# EAGLE schematic data board (EAGLE 9.6.2)
COMPANY: ADAFRUIT INDUSTRIES; DRAWN: LADYADA; REV: A
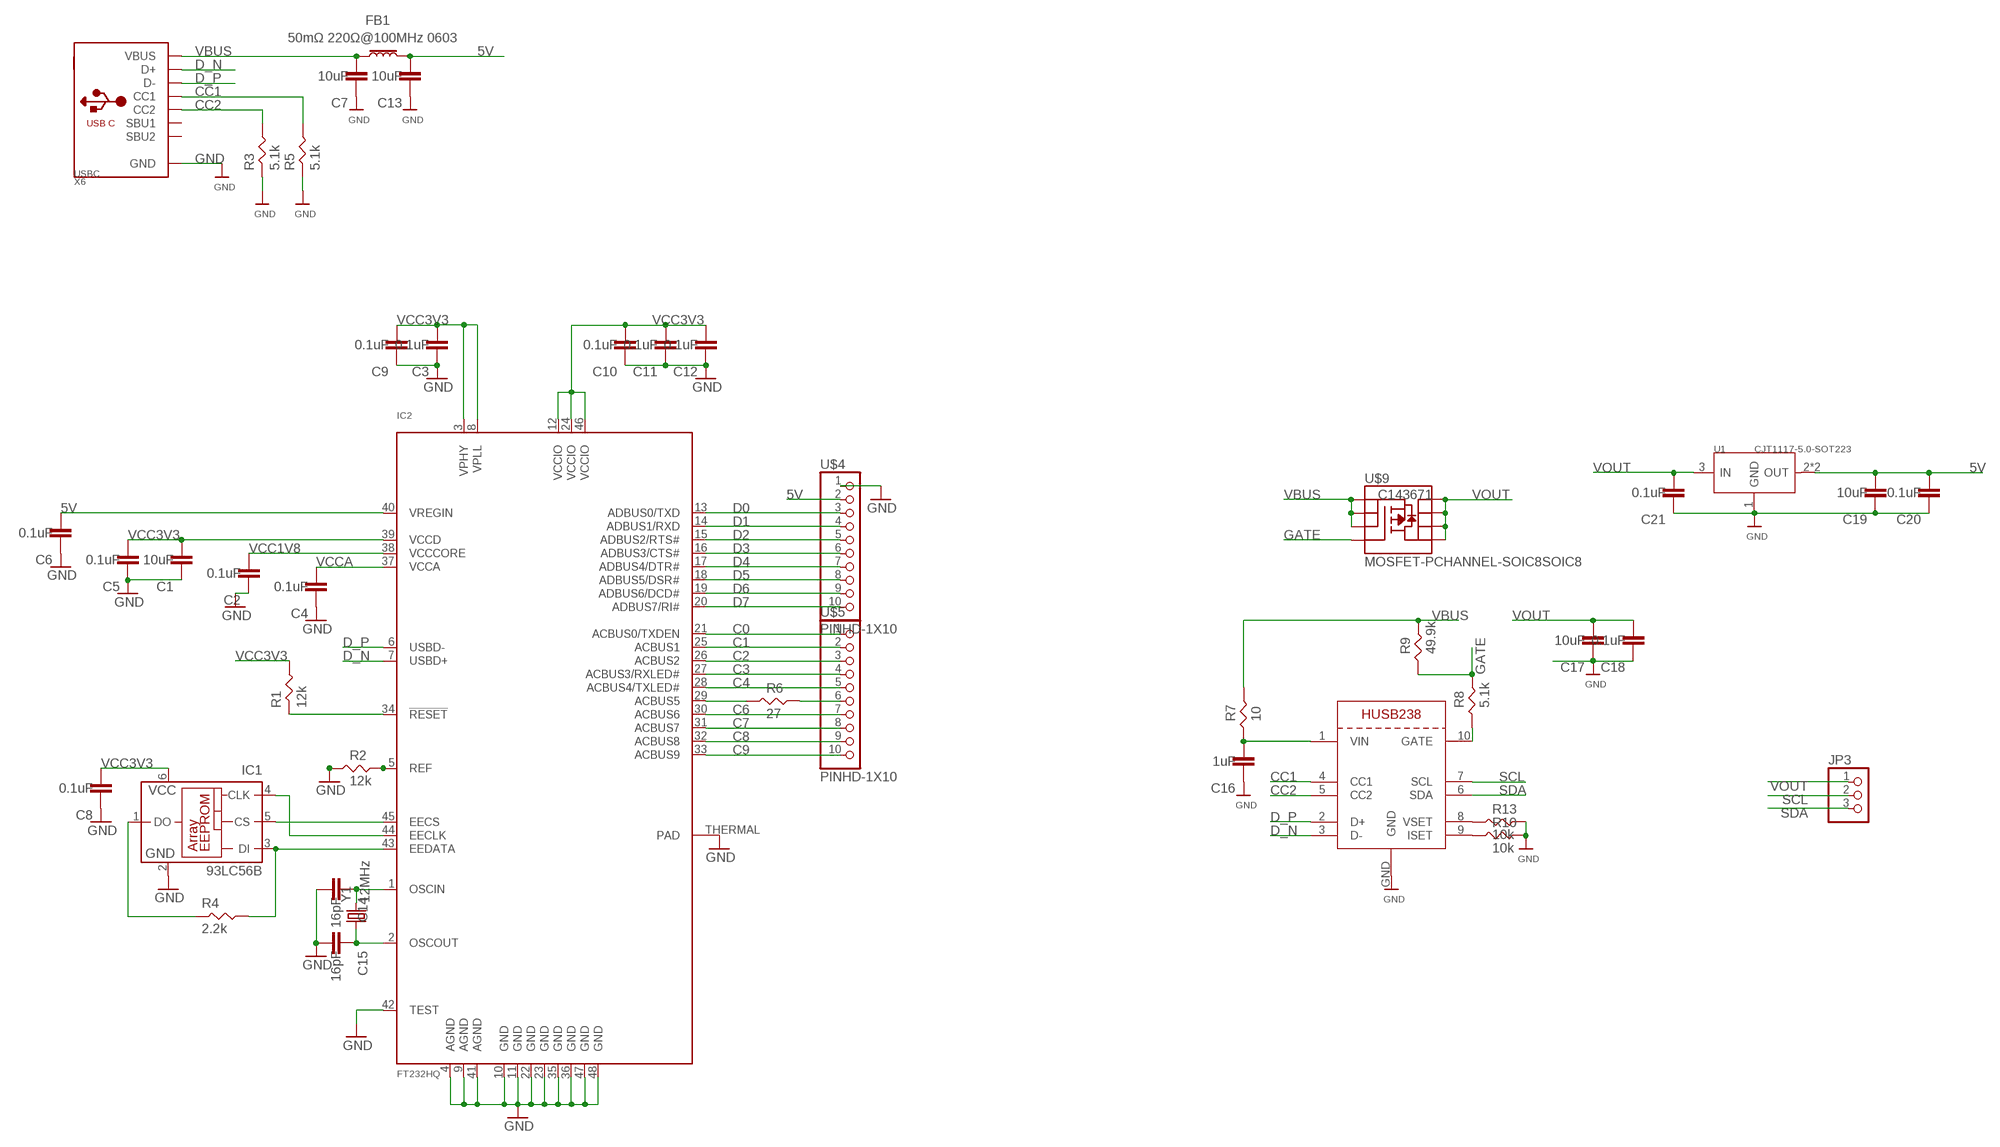
[diagram p0: schematic, sheet 1]

## Parts
C1  10uF  CAPACITOR_0805_N  [RESC0805_N]
C2  0.1uF  CAPACITOR_0402_N  [RESC0402_N]
C3  0.1uF  CAPACITOR_0402_N  [RESC0402_N]
C4  0.1uF  CAPACITOR_0402_N  [RESC0402_N]
C5  0.1uF  CAPACITOR_0402_N  [RESC0402_N]
C6  0.1uF  CAPACITOR_0402_N  [RESC0402_N]
C7  10uF  CAPACITOR_0805_N  [RESC0805_N]
C8  0.1uF  CAPACITOR_0402_N  [RESC0402_N]
C9  0.1uF  CAPACITOR_0402_N  [RESC0402_N]
C10  0.1uF  CAPACITOR_0402_N  [RESC0402_N]
C11  0.1uF  CAPACITOR_0402_N  [RESC0402_N]
C12  0.1uF  CAPACITOR_0402_N  [RESC0402_N]
C13  10uF  CAPACITOR_0805_N  [RESC0805_N]
C14  16pF  CAPACITOR_0402_N  [RESC0402_N]
C15  16pF  CAPACITOR_0402_N  [RESC0402_N]
C16  1uF  CAPACITOR_0402_N  [RESC0402_N]
C17  10uF  CAPACITOR_0805_N  [RESC0805_N]
C18  0.1uF  CAPACITOR_0402_N  [RESC0402_N]
C19  10uF  CAPACITOR_0805_N  [RESC0805_N]
C20  0.1uF  CAPACITOR_0402_N  [RESC0402_N]
C21  0.1uF  CAPACITOR_0402_N  [RESC0402_N]
FB1  50mΩ 220Ω@100MHz 0603  FERRITE_BEAD-0603  [0603]
IC1  93LC56B  93LC76A  [SOT23-6]
IC2  FT232HQ  [QFN48_8MM]
JP3  HEADER-1X3ROUND  [1X03_ROUND]
R1  12k  RES-0402  [RES-0402]
R2  12k  RES-0402  [RES-0402]
R3  5.1k  RES-0402  [RES-0402]
R4  2.2k  RES-0402  [RES-0402]
R5  5.1k  RES-0402  [RES-0402]
R6  27  RES-0402  [RES-0402]
R7  10  RES-0402  [RES-0402]
R8  5.1k  RES-0402  [RES-0402]
R9  49.9k  RES-0402  [RES-0402]
R10  10k  RES-0402  [RES-0402]
R13  10k  RES-0402  [RES-0402]
U1  CJT1117-5.0-SOT223  PMIC-CJT1117-5.0(SOT223)  [SOT-223]
U$4  PINHD-1X10  [1X10-BIG]
U$5  PINHD-1X10  [1X10-BIG]
U$9  MOSFET-PCHANNEL-SOIC8SOIC8  [SO08]
X3  HUSB238  [DFN10_3X3MM]
X6  USBC  USB_C  [USB_C_CUSB31-CFM2AX-01-X]
Y1  12MHz  CRYSTALCRYSTAL-SMD-5X3-12MHZ  [CRYSTAL-SMD-5X3]

## Nets
5V [power]: C6.2 C13.2 C19.2 C20.2 FB1.2 IC2.40(VREGIN) U1.2(OUT) U1.TER(OUT) U$4.2
C0: IC2.21(ACBUS0/TXDEN) U$5.1
C1: IC2.25(ACBUS1) U$5.2
C2: IC2.26(ACBUS2) U$5.3
C3: IC2.27(ACBUS3/RXLED#) U$5.4
C4: IC2.28(ACBUS4/TXLED#) U$5.5
C6: IC2.30(ACBUS6) U$5.7
C7: IC2.31(ACBUS7) U$5.8
C8: IC2.32(ACBUS8) U$5.9
C9: IC2.33(ACBUS9) U$5.10
CC1: R5.P$2 X3.4(CC1) X6.A5(CC1)
CC2: R3.P$2 X3.5(CC2) X6.B5(CC2)
D0: IC2.13(ADBUS0/TXD) U$4.3
D1: IC2.14(ADBUS1/RXD) U$4.4
D2: IC2.15(ADBUS2/RTS#) U$4.5
D3: IC2.16(ADBUS3/CTS#) U$4.6
D4: IC2.17(ADBUS4/DTR#) U$4.7
D5: IC2.18(ADBUS5/DSR#) U$4.8
D6: IC2.19(ADBUS6/DCD#) U$4.9
D7: IC2.20(ADBUS7/RI#) U$4.10
D_N: IC2.7(USBD+) X3.3(D-) X6.A6(D+) X6.B6(D+)
D_P: IC2.6(USBD-) X3.2(D+) X6.A7(D-) X6.B7(D-)
GATE: R8.P$2 R9.P$1 U$9.4(G)
GND: C1.1 C2.1 C3.1 C4.1 C5.1 C6.1 C7.1 C8.1 C9.1 C10.1 C11.1 C12.1 C13.1 C14.2 C15.2 C16.1 C17.1 C18.1 C19.1 C20.1 C21.1 IC1.2(GND) IC2.4(AGND) IC2.9(AGND) IC2.10(GND) IC2.11(GND) IC2.22(GND) IC2.23(GND) IC2.35(GND) IC2.36(GND) IC2.41(AGND) IC2.42(TEST) IC2.47(GND) IC2.48(GND) IC2.THERMAL(PAD) R2.P$1 R3.P$1 R5.P$1 R10.P$2 R13.P$2 U1.1(GND) U$4.1 X3.GND X6.A1B12(GND) X6.B1A12(GND)
N$1: IC2.5(REF) R2.P$2
N$2: C14.1 IC2.1(OSCIN) Y1.3
N$3: C15.1 IC2.2(OSCOUT) Y1.1
N$4: IC2.29(ACBUS5) R6.P$1
N$5: R6.P$2 U$5.6
N$6: C16.2 R7.P$1 X3.1(VIN)
N$7: IC2.34(!RESET) R1.P$1
N$8: R8.P$1 X3.10(GATE)
N$9: IC1.3(DI) IC2.43(EEDATA) R4.P$2
N$10: IC1.5(CS) IC2.45(EECS)
N$11: IC1.4(CLK) IC2.44(EECLK)
N$12: IC1.1(DO) R4.P$1
N$13: R13.P$1 X3.8(VSET)
N$14: R10.P$1 X3.9(ISET)
SCL: JP3.2 X3.7(SCL)
SDA: JP3.3 X3.6(SDA)
VBUS [power]: C7.2 FB1.1 R7.P$2 R9.P$2 U$9.1(S) U$9.2(S) U$9.3(S) X6.A4B9(VBUS) X6.B4A9(VBUS)
VCC1V8: C2.2 IC2.38(VCCCORE)
VCC3V3: C1.2 C3.2 C5.2 C8.2 C9.2 C10.2 C11.2 C12.2 IC1.6(VCC) IC2.3(VPHY) IC2.8(VPLL) IC2.12(VCCIO) IC2.24(VCCIO) IC2.39(VCCD) IC2.46(VCCIO) R1.P$2
VCCA: C4.2 IC2.37(VCCA)
VOUT: C17.2 C18.2 C21.2 JP3.1 U1.3(IN) U$9.5(D) U$9.6(D) U$9.7(D) U$9.8(D)
Unconnected: X6.A8(SBU1) X6.B8(SBU2)

## Library data of the parts
C1-C21 = Nordic_nRF:CAPACITOR: Generic chip capacitor
FB1 = SparkFun-Coils:FERRITE_BEAD: Ferrite Bead (blocks, cores, rings, chokes, etc.) Inductor with layers of ferrite used to suppress high frequencies. Often used to isolate high frequency noise. SparkFun Products: IOIO-OTG - V2.2 <https://www.sparkfun.com/products/13613> SparkFun SAMD21 Mini Breakout <https://www.sparkfun.com/products/13664> SparkFun 6 Degrees of Freedom Breakout - LSM6DS3 <https://www.sparkfun.com/products/13339> SparkFun SAMD21 Dev Breakout <https://www.sparkfun.com/products/13672>; PROD_ID: NDUC-07859; VALUE: 30Ω/1.8A
IC1 = microchip:93*76?: 8K Microwire Compatible Serial EEPROM Source: http://ww1.microchip.com/downloads/en/DeviceDoc/21796H.pdf; MF: MICROCHIP; MPN: 93LC76AT-I/OT; OC_FARNELL: 1556170; OC_NEWARK: 61H6824
IC2 = microbuilder:FT232H
JP3 = microbuilder:HEADER-1X3: PIN HEADER
R1-R10 R13 = FlashPCB_Resistors:RES-0402: https://www.digikey.com/en/products/filter/chip-resistor-surface-mount/52?s=N4IgjCBcpgbFoDGUBmBDANgZwKYBoQB7KAbRAGYBOAJgBZ4BdAgBwBcoQBlVgJwEsAdgHMQAX1EFqpEDxxY%2BWVoR4gGooA
U1 = Seeed-IC:PMIC-CJT1117-5.0(SOT223): 310030096; MPN: CJT1117-5.0
U$4 U$5 = adafruit:PINHD-1X10: Pin header 1x10 0.1" spacing With round pins
U$9 = SparkFun-DiscreteSemi:MOSFET-PCHANNEL-SOIC8: Generic 8-pin PMOSFET; LCSC: C143671
X3 = adafruit_power:HUSB238
X6 = microbuilder:USB_C: USB Type-C USB 2.0 Connector
Y1 = SparkFun-FreqCtrl:CRYSTAL: Various standard crystals. Proven footprints.; LCSC: C2901628; PROD_ID: XTAL-08297

## Net classes
1 power: width 0.305 mm
2 gnd: width 0.254 mm